# EAGLE design BBB_JTAG_CTI20_SMT_TI20_SMT (EAGLE 7.6.0)
DESIGNER: Michal Morawiec
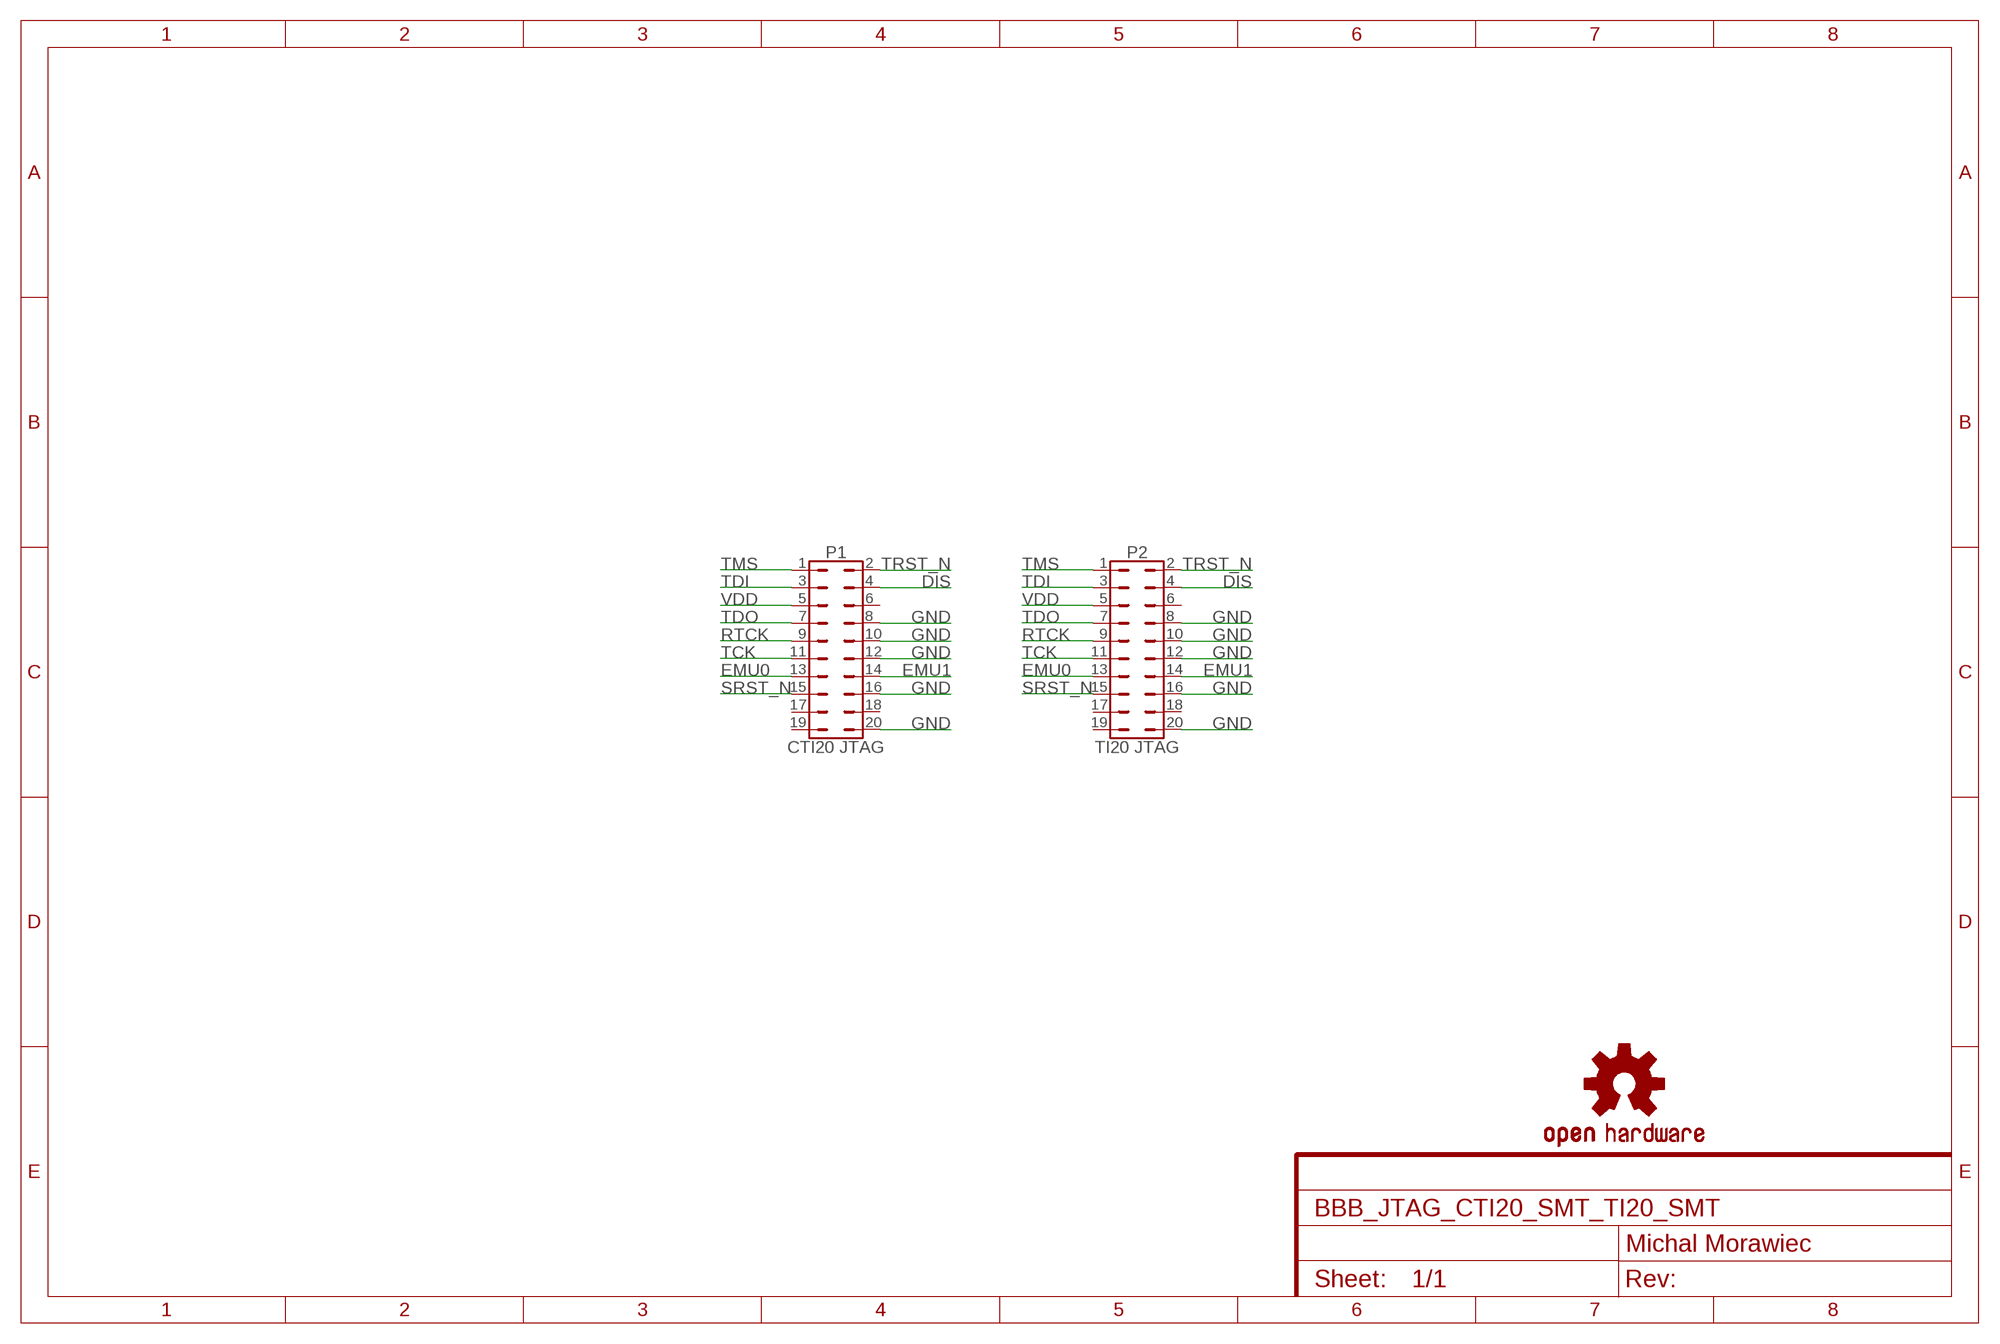
[diagram p0: schematic, sheet 1]
FRAME1 (FRAME-A4L): CREVISION: 1.0

## Parts
LOGO1  OSHW-LOGOS  [OSHW-LOGO-S]
P1  CTI20 JTAG  M52-5151045  [M52-5151045]
P2  TI20 JTAG  T821M120A1S100CEU-B  [T821M120A1S100CEU-B]

## Nets
DIS: P1.4 P2.4
EMU0: P1.13 P2.13
EMU1: P1.14 P2.14
GND: P1.8 P1.10 P1.12 P1.16 P1.20 P2.8 P2.10 P2.12 P2.16 P2.20
RTCK: P1.9 P2.9
SRST_N: P1.15 P2.15
TCK: P1.11 P2.11
TDI: P1.3 P2.3
TDO: P1.7 P2.7
TMS: P1.1 P2.1
TRST_N: P1.2 P2.2
VDD: P1.5 P2.5
Unconnected: P1.6 P1.17 P1.18 P1.19 P2.6 P2.17 P2.18 P2.19

## Library data of the parts
LOGO1 = SparkFun-Aesthetics:OSHW-LOGO: Open Source Hardware Logo This logo indicates the piece of hardware it is found on incorporates a OSHW license and/or adheres to the definition of open source hardware found here: http://freedomdefined.org/OSHW
P1 = connectors:M52-5151045: HARWIN Archer M52-5151045
P2 = connectors:T821M120A1S100CEU-B: AMPHENOL T821M120A1S100CEU -B

## Board
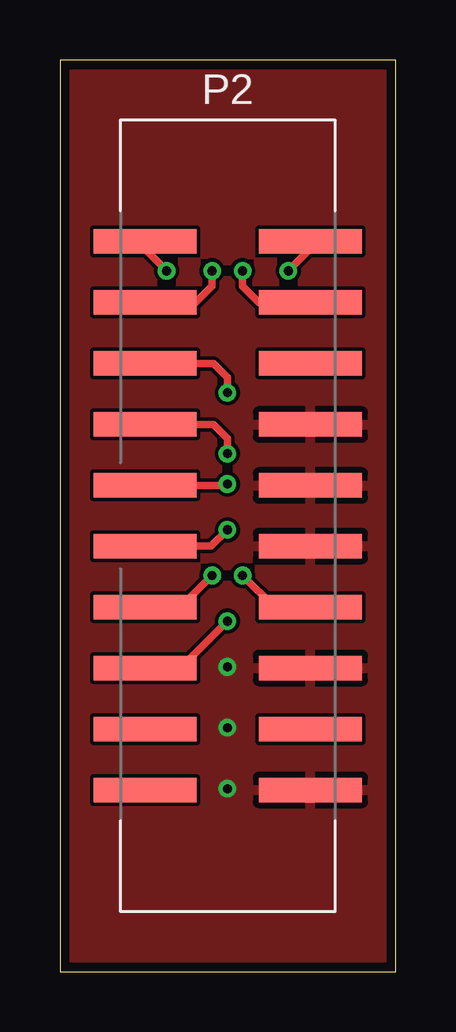
[diagram p1: board, top side]
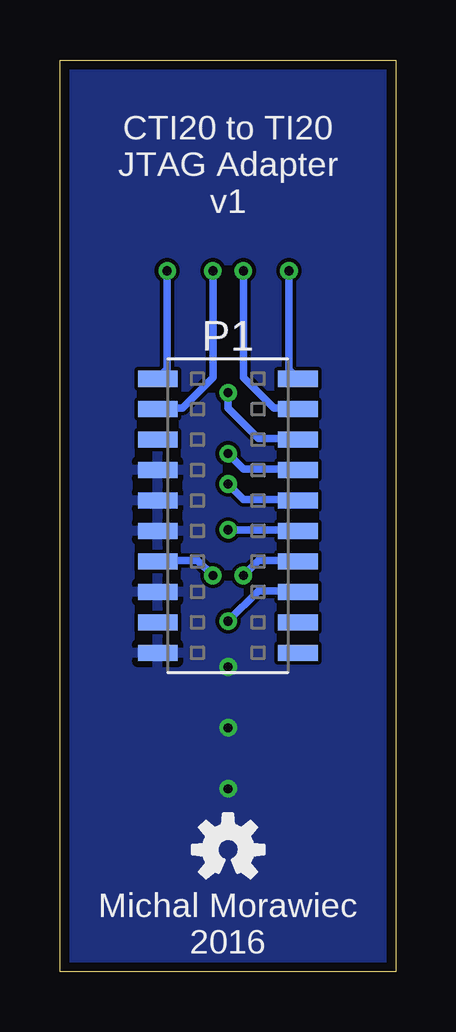
[diagram p2: board, bottom side, seen from below]

Size 14 x 38 mm. Coordinates in mm from the lower left corner, seen from the top.
Outline: 0,0 14,0 14,38 0,38 0,0
Copper layers (1*16): Top 0.0356mm / dielectric 1.5011mm / Bottom 0.0356mm
Design rules "LaenPCBOrder": minimum track width 6mil, minimum drill 13mil, track to track 6mil, track to pad 6mil, pad to pad 6mil, via to via 6mil, smd to smd 6mil, copper to edge 15mil, drill to drill 6mil, minimum pad ring 7mil, minimum via ring 7mil, stop-mask expansion 3mil, vias tented up to drill 0mil, thermal gap 10mil

### Footprints (pad centres in the part's own frame; a part is rotated, then mirrored left to right if it is on the bottom)
M52-5151045 = smd 0.68 x 1.65: 1 -5.715,2.925; 2 -5.715,-2.925; 3 -4.445,2.925; 4 -4.445,-2.925; 5 -3.175,2.925; 6 -3.175,-2.925; 7 -1.905,2.925; 8 -1.905,-2.925; 9 -0.635,2.925; 10 -0.635,-2.925; 11 0.635,2.925; 12 0.635,-2.925; 13 1.905,2.925; 14 1.905,-2.925; 15 3.175,2.925; 16 3.175,-2.925; 17 4.445,2.925; 18 4.445,-2.925; 19 5.715,2.925; 20 5.715,-2.925
T821M120A1S100CEU-B = smd 1.02 x 4.3: 1 -11.43,-3.45; 2 -11.43,3.45; 3 -8.89,-3.45; 4 -8.89,3.45; 5 -6.35,-3.45; 6 -6.35,3.45; 7 -3.81,-3.45; 8 -3.81,3.45; 9 -1.27,-3.45; 10 -1.27,3.45; 11 1.27,-3.45; 12 1.27,3.45; 13 3.81,-3.45; 14 3.81,3.45; 15 6.35,-3.45; 16 6.35,3.45; 17 8.89,-3.45; 18 8.89,3.45; 19 11.43,-3.45; 20 11.43,3.45

### Placement (x,y rotation side)
LOGO1  6.99,5.08 0 bottom
P1  7,19 270 bottom
P2  7,19 270 top

### Tracks (layer width: path | path; a pad name or v marks a point on that pad's centre or on a via)
DIS  (via drill 0.38)
  Top 0.305: P2.4 8.3,27.89 7.62,28.57 v7.62,29.21
  Bottom 0.305: v7.62,29.21 7.62,24.77 8.89,23.5 9.88,23.5 P1.4
EMU0  (via drill 0.38)
  Top 0.305: P2.13 5.03,15.19 v6.35,16.51
  Bottom 0.305: v6.35,16.51 5.71,17.14 4.12,17.14 P1.13
EMU1  (via drill 0.38)
  Top 0.305: P2.14 8.94,15.19 v7.62,16.51
  Bottom 0.305: v7.62,16.51 8.26,17.14 9.88,17.14 P1.14
GND  (via drill 0.38)
  other vias: 6.99,12.7 6.99,10.16 6.99,7.62
  pour Bottom: 0,0 0,38 14,38 14,0
  pour Top: 0,0 0,38 14,38 14,0
N$13  (via drill 0.38)
  other vias: 9.53,29.21
N$14  (via drill 0.38)
  other vias: 4.45,29.21
N$15  (via drill 0.38)
  other vias: 6.35,29.21
N$16  (via drill 0.38)
  other vias: 7.62,29.21
N$17  (via drill 0.38)
  other vias: 6.99,24.13
N$18  (via drill 0.38)
  other vias: 6.99,21.59
N$20  (via drill 0.38)
  other vias: 6.99,18.41
N$21  (via drill 0.38)
  other vias: 6.35,16.51
N$22  (via drill 0.38)
  other vias: 7.62,16.51
RTCK  (via drill 0.38)
  Top 0.305: P2.9 6.93,20.27 v6.99,20.32
  Bottom 0.305: v6.99,20.32 6.35,19.68 4.12,19.68 P1.9
S$1  (via drill 0.38)
  other vias: 6.99,20.32
S$2  (via drill 0.38)
  other vias: 6.99,14.61
SRST_N  (via drill 0.38)
  Top 0.305: P2.15 5.03,12.65 v6.99,14.61
  Bottom 0.305: v6.99,14.61 5.71,15.88 4.12,15.88 P1.15
TCK  (via drill 0.38)
  Top 0.305: P2.11 6.3,17.73 v6.99,18.41
  Bottom 0.305: v6.99,18.41 4.12,18.41 P1.11
TDI  (via drill 0.38)
  Top 0.305: P2.3 5.67,27.89 6.35,28.57 v6.35,29.21
  Bottom 0.305: v6.35,29.21 6.35,24.77 5.08,23.5 4.12,23.5 P1.3
TDO  (via drill 0.38)
  Top 0.305: P2.7 6.4,22.81 6.99,22.23 v6.99,21.59
  Bottom 0.305: v6.99,21.59 6.35,20.95 4.12,20.95 P1.7
TMS  (via drill 0.38)
  Top 0.305: P2.1 3.55,30.11 v4.45,29.21
  Bottom 0.305: v4.45,29.21 4.45,25.09 P1.1
TRST_N  (via drill 0.38)
  Top 0.305: P2.2 10.45,30.14 v9.53,29.21
  Bottom 0.305: v9.53,29.21 9.53,25.11 P1.2
VDD  (via drill 0.38)
  Top 0.305: P2.5 6.4,25.35 6.99,24.77 v6.99,24.13
  Bottom 0.305: v6.99,24.13 6.99,23.5 5.71,22.23 4.12,22.23 P1.5

### Text on the board
bNames: CTI20 to TI20 / JTAG Adapter / v1 | Michal Morawiec / 2016